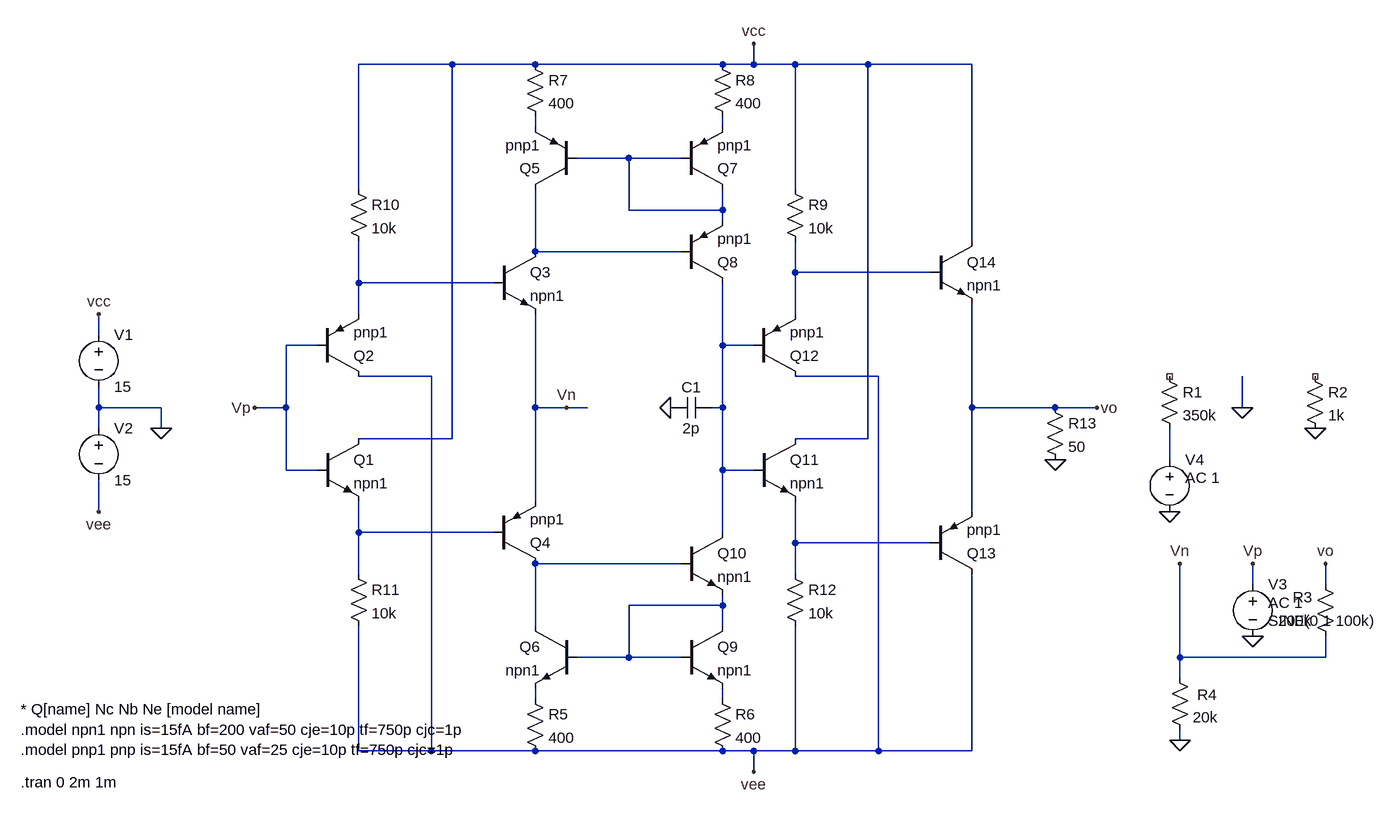
[diagram p0: schematic transimpedance.asc]
transimpedance.asc, the LTspice schematic file:
Version 4
SHEET 1 1972 680
WIRE 528 -976 384 -976
WIRE 656 -976 528 -976
WIRE 944 -976 656 -976
WIRE 992 -976 992 -1008
WIRE 992 -976 944 -976
WIRE 1056 -976 992 -976
WIRE 1168 -976 1056 -976
WIRE 1328 -976 1168 -976
WIRE 656 -880 656 -896
WIRE 944 -880 944 -896
WIRE 800 -832 720 -832
WIRE 880 -832 800 -832
WIRE 384 -784 384 -976
WIRE 1056 -784 1056 -976
WIRE 800 -752 800 -832
WIRE 944 -752 944 -784
WIRE 944 -752 800 -752
WIRE 944 -736 944 -752
WIRE 1328 -704 1328 -976
WIRE 656 -688 656 -784
WIRE 880 -688 656 -688
WIRE 1056 -656 1056 -704
WIRE 1264 -656 1056 -656
WIRE 384 -640 384 -704
WIRE 592 -640 384 -640
WIRE 384 -592 384 -640
WIRE 1056 -592 1056 -656
WIRE -16 -560 -16 -592
WIRE 320 -544 272 -544
WIRE 944 -544 944 -640
WIRE 992 -544 944 -544
WIRE 496 -496 384 -496
WIRE 1184 -496 1056 -496
WIRE -16 -448 -16 -480
WIRE 80 -448 -16 -448
WIRE 272 -448 272 -544
WIRE 272 -448 224 -448
WIRE 656 -448 656 -592
WIRE 704 -448 656 -448
WIRE 736 -448 704 -448
WIRE 944 -448 944 -544
WIRE 944 -448 928 -448
WIRE 1328 -448 1328 -608
WIRE 1456 -448 1328 -448
WIRE 1520 -448 1456 -448
WIRE 1744 -448 1744 -496
WIRE -16 -416 -16 -448
WIRE 80 -416 80 -448
WIRE 528 -400 528 -976
WIRE 528 -400 384 -400
WIRE 1168 -400 1168 -976
WIRE 1168 -400 1056 -400
WIRE 1632 -368 1632 -416
WIRE 272 -352 272 -448
WIRE 320 -352 272 -352
WIRE 944 -352 944 -448
WIRE 992 -352 944 -352
WIRE 656 -304 656 -448
WIRE -16 -288 -16 -336
WIRE 1328 -288 1328 -448
WIRE 384 -256 384 -304
WIRE 592 -256 384 -256
WIRE 944 -256 944 -352
WIRE 1056 -240 1056 -304
WIRE 1264 -240 1056 -240
WIRE 880 -208 656 -208
WIRE 384 -192 384 -256
WIRE 1056 -192 1056 -240
WIRE 1760 -176 1760 -208
WIRE 1872 -176 1872 -208
WIRE 944 -144 944 -160
WIRE 944 -144 800 -144
WIRE 656 -112 656 -208
WIRE 944 -112 944 -144
WIRE 800 -64 800 -144
WIRE 800 -64 720 -64
WIRE 880 -64 800 -64
WIRE 1648 -64 1648 -208
WIRE 1872 -64 1872 -96
WIRE 1872 -64 1648 -64
WIRE 1648 -32 1648 -64
WIRE 656 0 656 -16
WIRE 944 0 944 -16
WIRE 1648 64 1648 48
WIRE 384 80 384 -112
WIRE 496 80 496 -496
WIRE 496 80 384 80
WIRE 656 80 496 80
WIRE 944 80 656 80
WIRE 992 80 944 80
WIRE 1056 80 1056 -112
WIRE 1056 80 992 80
WIRE 1184 80 1184 -496
WIRE 1184 80 1056 80
WIRE 1328 80 1328 -192
WIRE 1328 80 1184 80
WIRE 992 112 992 80
FLAG 704 -448 Vn
FLAG 224 -448 Vp
FLAG 992 -1008 vcc
FLAG 992 112 vee
FLAG 80 -416 0
FLAG -16 -288 vee
FLAG -16 -592 vcc
FLAG 1520 -448 vo
FLAG 1632 -288 0
FLAG 1744 -448 0
FLAG 1760 -208 Vp
FLAG 1648 -208 Vn
FLAG 1856 -416 0
FLAG 1872 -208 vo
FLAG 1760 -96 0
FLAG 1648 64 0
FLAG 864 -448 0
FLAG 1456 -368 0
SYMBOL npn 320 -400 R0
SYMATTR InstName Q1
SYMATTR Value npn1
SYMBOL pnp 320 -496 M180
SYMATTR InstName Q2
SYMATTR Value pnp1
SYMBOL npn 592 -688 R0
SYMATTR InstName Q3
SYMATTR Value npn1
SYMBOL pnp 592 -208 M180
SYMATTR InstName Q4
SYMATTR Value pnp1
SYMBOL pnp 720 -784 R180
SYMATTR InstName Q5
SYMATTR Value pnp1
SYMBOL npn 720 -112 M0
SYMATTR InstName Q6
SYMATTR Value npn1
SYMBOL voltage -16 -576 R0
WINDOW 123 0 0 Left 0
WINDOW 39 0 0 Left 0
SYMATTR InstName V1
SYMATTR Value 15
SYMBOL voltage -16 -432 R0
WINDOW 123 0 0 Left 0
WINDOW 39 0 0 Left 0
SYMATTR InstName V2
SYMATTR Value 15
SYMBOL pnp 880 -784 M180
SYMATTR InstName Q7
SYMATTR Value pnp1
SYMBOL pnp 880 -640 M180
SYMATTR InstName Q8
SYMATTR Value pnp1
SYMBOL npn 880 -112 R0
SYMATTR InstName Q9
SYMATTR Value npn1
SYMBOL npn 880 -256 R0
SYMATTR InstName Q10
SYMATTR Value npn1
SYMBOL npn 992 -400 R0
SYMATTR InstName Q11
SYMATTR Value npn1
SYMBOL pnp 992 -496 M180
SYMATTR InstName Q12
SYMATTR Value pnp1
SYMBOL pnp 1264 -192 M180
SYMATTR InstName Q13
SYMATTR Value pnp1
SYMBOL npn 1264 -704 R0
SYMATTR InstName Q14
SYMATTR Value npn1
SYMBOL voltage 1632 -384 R0
WINDOW 123 24 44 Left 0
WINDOW 39 0 0 Left 0
SYMATTR Value2 AC 1
SYMATTR InstName V4
SYMATTR Value ""
SYMBOL res 1616 -512 R0
SYMATTR InstName R1
SYMATTR Value 350k
SYMBOL res 1840 -512 R0
SYMATTR InstName R2
SYMATTR Value 1k
SYMBOL voltage 1760 -192 R0
WINDOW 123 24 44 Left 0
WINDOW 39 0 0 Left 0
WINDOW 3 24 72 Left 0
SYMATTR Value2 AC 1
SYMATTR InstName V3
SYMATTR Value SINE(0 1 100k)
SYMBOL res 1888 -80 R180
WINDOW 0 36 76 Left 0
WINDOW 3 36 40 Left 0
SYMATTR InstName R3
SYMATTR Value 200k
SYMBOL res 1632 -48 R0
WINDOW 0 43 42 Left 0
SYMATTR InstName R4
SYMATTR Value 20k
SYMBOL res 640 -16 R0
SYMATTR InstName R5
SYMATTR Value 400
SYMBOL res 928 -16 R0
SYMATTR InstName R6
SYMATTR Value 400
SYMBOL res 640 -992 R0
SYMATTR InstName R7
SYMATTR Value 400
SYMBOL res 928 -992 R0
SYMATTR InstName R8
SYMATTR Value 400
SYMBOL cap 928 -464 R90
WINDOW 0 0 32 VBottom 0
WINDOW 3 32 32 VTop 0
SYMATTR InstName C1
SYMATTR Value 2p
SYMBOL res 1040 -800 R0
SYMATTR InstName R9
SYMATTR Value 10k
SYMBOL res 368 -800 R0
SYMATTR InstName R10
SYMATTR Value 10k
SYMBOL res 368 -208 R0
SYMATTR InstName R11
SYMATTR Value 10k
SYMBOL res 1040 -208 R0
SYMATTR InstName R12
SYMATTR Value 10k
SYMBOL res 1440 -464 R0
SYMATTR InstName R13
SYMATTR Value 50
TEXT -136 16 Left 0 !* Q[name] Nc Nb Ne [model name]\n.model npn1 npn is=15fA bf=200 vaf=50 cje=10p tf=750p cjc=1p\n.model pnp1 pnp is=15fA bf=50 vaf=25 cje=10p tf=750p cjc=1p
TEXT -136 128 Left 0 !.tran 0 2m 1m

The netlist it stands for:
* transimpedance.asc
Q1 vcc Vp N009 0 npn1
Q2 vee Vp N006 0 pnp1
Q3 N004 N006 Vn 0 npn1
Q4 N011 N009 Vn 0 pnp1
Q5 N004 N003 N001 0 pnp1
Q6 N011 N012 N013 0 npn1
V1 vcc 0 15
V2 0 vee 15
Q7 N003 N003 N002 0 pnp1
Q8 N007 N004 N003 0 pnp1
Q9 N012 N012 N014 0 npn1
Q10 N007 N011 N012 0 npn1
Q11 vcc N007 N010 0 npn1
Q12 vee N007 N005 0 pnp1
Q13 vee N010 vo 0 pnp1
Q14 vcc N005 vo 0 npn1
V4 N008 0 AC 1
R1 NC_01 N008 350k
R2 NC_02 0 1k
V3 Vp 0 SINE(0 1 100k) AC 1
R3 Vn vo 200k
R4 Vn 0 20k
R5 N013 vee 400
R6 N014 vee 400
R7 vcc N001 400
R8 vcc N002 400
C1 N007 0 2p
R9 vcc N005 10k
R10 vcc N006 10k
R11 N009 vee 10k
R12 N010 vee 10k
R13 vo 0 50
.model NPN NPN
.model PNP PNP
.lib standard.bjt
* Q[name] Nc Nb Ne [model name]
.model npn1 npn is=15fA bf=200 vaf=50 cje=10p tf=750p cjc=1p
.model pnp1 pnp is=15fA bf=50 vaf=25 cje=10p tf=750p cjc=1p
.tran 0 2m 1m
.backanno
.end